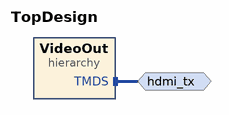
[diagram p0: block diagram of the top level]
# Vivado block design TopDesign, xc7z020clg400-1, Vivado 2018.3
create_bd_design TopDesign

create_bd_intf_port -mode Master -vlnv digilentinc.com:interface:tmds_rtl:1.0 hdmi_tx

create_bd_cell -type hier VideoOut

# ---- hierarchy /VideoOut ----
current_bd_instance /VideoOut
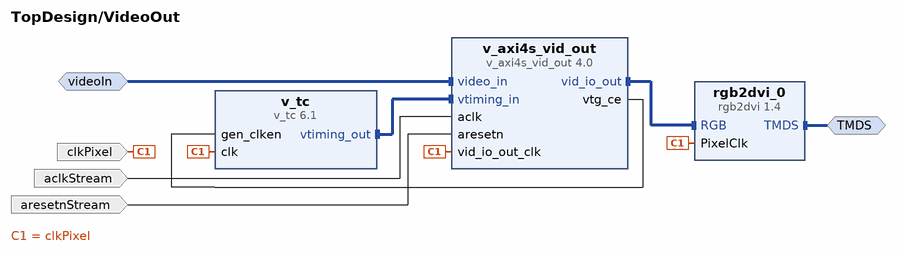
[diagram p1: block diagram inside /VideoOut]
create_bd_intf_pin -mode Master -vlnv digilentinc.com:interface:tmds_rtl:1.0 TMDS
create_bd_intf_pin -mode Slave -vlnv xilinx.com:interface:axis_rtl:1.0 videoIn
create_bd_pin -dir I -type clk clkPixel
create_bd_pin -dir I -type clk aclkStream
create_bd_pin -dir I -type rst aresetnStream

create_bd_cell -type ip -vlnv xilinx.com:ip:v_axi4s_vid_out:4.0 v_axi4s_vid_out
set_property -dict {CONFIG.C_HAS_ASYNC_CLK 1} [get_bd_cells v_axi4s_vid_out]
create_bd_cell -type ip -vlnv xilinx.com:ip:v_tc:6.1 v_tc
set_property -dict {CONFIG.HAS_AXI4_LITE false CONFIG.VIDEO_MODE 800x600p CONFIG.enable_detection false} [get_bd_cells v_tc]
create_bd_cell -type ip -vlnv digilentinc.com:ip:rgb2dvi:1.4 rgb2dvi_0
set_property -dict {CONFIG.kClkRange 3 CONFIG.kRstActiveHigh true} [get_bd_cells rgb2dvi_0]

# ---- connections ----

current_bd_instance /VideoOut
connect_bd_intf_net [get_bd_intf_pins TMDS] [get_bd_intf_pins rgb2dvi_0/TMDS]
connect_bd_intf_net [get_bd_intf_pins videoIn] [get_bd_intf_pins v_axi4s_vid_out/video_in]
connect_bd_intf_net -intf_net v_tc_0_vtiming_out [get_bd_intf_pins v_tc/vtiming_out] [get_bd_intf_pins v_axi4s_vid_out/vtiming_in]
connect_bd_intf_net -intf_net v_axi4s_vid_out_0_vid_io_out [get_bd_intf_pins v_axi4s_vid_out/vid_io_out] [get_bd_intf_pins rgb2dvi_0/RGB]
connect_bd_net -net v_axi4s_vid_out_0_vtg_ce [get_bd_pins v_axi4s_vid_out/vtg_ce] [get_bd_pins v_tc/gen_clken]
connect_bd_net -net clk_0_1 [get_bd_pins clkPixel] \
  [get_bd_pins v_tc/clk] [get_bd_pins v_axi4s_vid_out/vid_io_out_clk] [get_bd_pins rgb2dvi_0/PixelClk]
connect_bd_net -net aclk_0_1 [get_bd_pins aclkStream] [get_bd_pins v_axi4s_vid_out/aclk]
connect_bd_net -net aresetn_0_1 [get_bd_pins aresetnStream] [get_bd_pins v_axi4s_vid_out/aresetn]

current_bd_instance /
connect_bd_intf_net [get_bd_intf_ports hdmi_tx] [get_bd_intf_pins VideoOut/TMDS]

validate_bd_design
save_bd_design
